# Altium project STM_32.PrjPcb
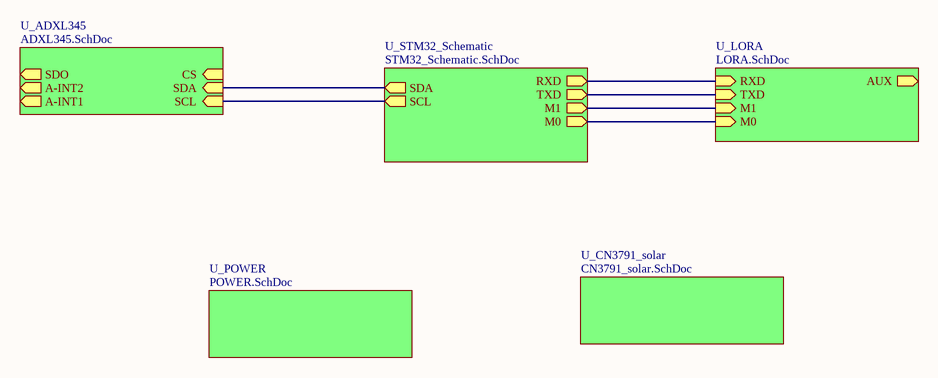
[diagram p0: Overview.SchDoc]
6 sheets, 61 parts. Net scope: hierarchical (ports join the sheet entries above them; power ports are global).
Board file: cuong.PcbDoc
Sheets:
  Overview.SchDoc
    U_STM32_Schematic = STM32_Schematic.SchDoc
    U_ADXL345 = ADXL345.SchDoc
    U_LORA = LORA.SchDoc
    U_POWER = POWER.SchDoc
    U_CN3791_solar = CN3791_solar.SchDoc

## Sheet Overview.SchDoc
size A; SheetNumber: 1; SheetTotal: 6

### Sub-sheets
U_ADXL345 = ADXL345.SchDoc: SCL (in), SDA (in), A-INT1 (out), A-INT2 (out), SDO (out), CS (in)
U_CN3791_solar = CN3791_solar.SchDoc: no entries
U_LORA = LORA.SchDoc: AUX (out), RXD (in), TXD (in), M0 (in), M1 (in)
U_POWER = POWER.SchDoc: no entries
U_STM32_Schematic = STM32_Schematic.SchDoc: RXD (out), TXD (out), M1 (out), M0 (out), SDA (out), SCL (out)

### Nets
NetR14_1: sheet U_STM32_Schematic/SCL, sheet U_ADXL345/SCL
NetR16_1: sheet U_STM32_Schematic/SDA, sheet U_ADXL345/SDA
NetU1_17: sheet U_STM32_Schematic/M0, sheet U_LORA/M0
NetU1_29: sheet U_STM32_Schematic/M1, sheet U_LORA/M1
NetU1_30: sheet U_STM32_Schematic/RXD, sheet U_LORA/RXD
NetU1_31: sheet U_STM32_Schematic/TXD, sheet U_LORA/TXD

## Sheet STM32_Schematic.SchDoc
size A4; SheetNumber: 4; SheetTotal: 6
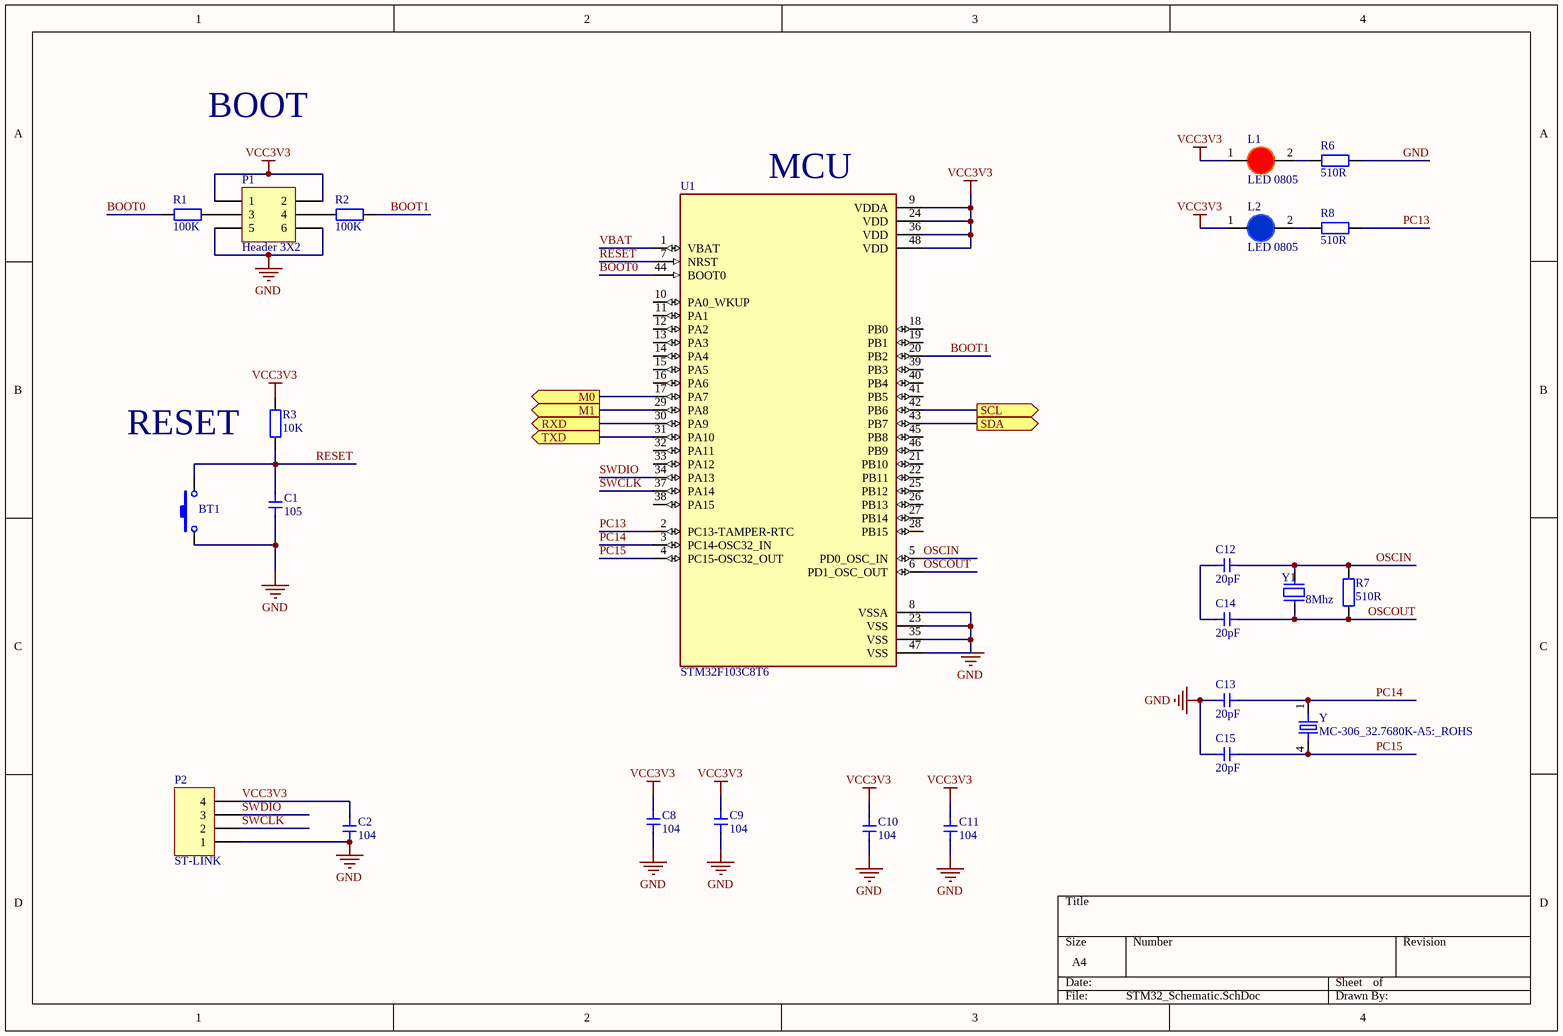
[diagram p1: STM32_Schematic.SchDoc]

### Parts
BT1  Nut Nhan 2 Chan SMD 3x6x2.5  [Nut Nhan 2 Chan SMD 3x6x2.5]  (value not drawn)
C1  105  [Cap 0805]
C2  104  [Cap 0805]
C8  104  [Cap 0805]
C9  104  [Cap 0805]
C10  104  [Cap 0805]
C11  104  [Cap 0805]
C12  20pF  [Cap 0805]
C13  20pF  [Cap 0805]
C14  20pF  [Cap 0805]
C15  20pF  [Cap 0805]
L1  LED 0805  [LED-0805-Red]
L2  LED 0805  [LED-0805-Blue]
P1  Header 3X2  [HDR2X3]
P2  ST-LINK  [HDR1X4]
R1  100K  [tro smd 0805]
R2  100K  [tro smd 0805]
R3  10K  [tro smd 0805]
R6  510R  [tro smd 0805]
R7  510R  [tro smd 0805]
R8  510R  [tro smd 0805]
U1  STM32F103C8T6  [QFP50P900X900X160-48N]
Y  MC-306_32.7680K-A5:_ROHS  [OSCL550P800X320X254-4N]
Y1  8Mhz  [Thach Anh 2 chan SMD5032]

### Ports
M0 (out), M1 (out), RXD (out), SCL (out), SDA (out), TXD (out)

### Nets
GND: BT1.1 C1.1 C2.1 C8.1 C9.1 C10.1 C11.1 C13.2 C15.2 P1.5 P1.6 P2.1 R6.2 U1.8(VSSA) U1.23(VSS) U1.35(VSS) U1.47(VSS)
VCC3V3: C2.2 C8.2 C9.2 C10.2 C11.2 L1.1(A) L2.1(A) P1.1 P1.2 P2.4 R3.2 U1.9(VDDA) U1.24(VDD) U1.36(VDD) U1.48(VDD)
BOOT0: R1.2 U1.44(BOOT0)
BOOT1: R2.1 U1.20(PB2)
OSCIN: C12.1 R7.2 U1.5(PD0_OSC_IN) Y1.1
OSCOUT: C14.1 R7.1 U1.6(PD1_OSC_OUT) Y1.2
PC13: R8.2 U1.2(PC13-TAMPER-RTC)
PC14: C13.1 U1.3(PC14-OSC32_IN) Y.1
PC15: C15.1 U1.4(PC15-OSC32_OUT) Y.4
RESET: BT1.2 C1.2 R3.1 U1.7(NRST)
SWCLK: P2.2 U1.37(PA14)
SWDIO: P2.3 U1.34(PA13)
VBAT: U1.1(VBAT)
NetC12_2: C12.2 C14.2
NetL1_2: L1.2(K) R6.1
NetL2_2: L2.2(K) R8.1
NetP1_3: P1.3 R1.1
NetP1_4: P1.4 R2.2
NetR14_1: U1.42(PB6) ; port SCL
NetR16_1: U1.43(PB7) ; port SDA
NetU1_17: U1.17(PA7) ; port M0
NetU1_29: U1.29(PA8) ; port M1
NetU1_30: U1.30(PA9) ; port RXD
NetU1_31: U1.31(PA10) ; port TXD

Not connected (* = marked no-connect by the designer): U1 10(PA0_WKUP) 11(PA1) 12(PA2) 13(PA3) 14(PA4) 15(PA5) 16(PA6) 18(PB0) 19(PB1) 21(PB10) 22(PB11) 25(PB12) 26(PB13) 27(PB14) 28(PB15) 32(PA11) 33(PA12) 38(PA15) 39(PB3) 40(PB4) 41(PB5) 45(PB8) 46(PB9)

### Notes on the sheet
- BOOT
- (near U1) MCU
- RESET

### Library data of the parts
BT1 = Nut Nhan 2 Chan SMD 3x6x2.5: Ma_Hang: MH001036; Ten: Nút Nhấn 2 Chân 3x6x2.5MM SMD
C1 C2 C8-C15 = Cap 0805: Capacitor SMD 0805
L1 = LED 0805 Do: Dán; Don_Vi: Con; Ma_Hang: MH000897; Ten_Linh_Kien: LED 0805 Màu Đỏ (Red); Ghi_Chu: *; Kieu_Chan: *; Chung_Loai: Dán
L2 = LED 0805 Xanh Duong: Dán; Don_Vi: Con; Ma_Hang: MH002327; Ten_Linh_Kien: LED 0805 Màu Xanh Dương (Blue); Ghi_Chu: *; Kieu_Chan: *; Chung_Loai: Dán
P1 = Header 3X2: Header, 3-Pin, Dual row; LatestRevisionDate: 17-Jul-2002; LatestRevisionNote: Re-released for DXP Platform.; Publisher: Altium Limited
P2 = Header 4: Header, 4-Pin; LatestRevisionDate: 17-Jul-2002; LatestRevisionNote: Re-released for DXP Platform.; Publisher: Altium Limited
R1-R3 R6-R8 = Tro 0805 1% 0.5R: Dán; Don_Vi: Con; So_Chan: 2; Ten_Linh_Kien: Trở 0805 1% 0.5R; Ma_Hang: MH005465; Chung_Loai: Dán; Kieu_Chan: *
U1 = STM32F103C8T6: ARM® Cortex®-M3 STM32F1 Microcontroller IC 32-Bit 72MHz 64KB (64K x 8) FLASH 48-LQFP (7x7); MF: STMicroelectronics; SnapEDA_Link: https://www.snapeda.com/parts/STM32F103C8T6/STMicroelectronics/view-part/?ref=snap; Package: LQFP-48 STMicroelectronics; Value: *; MP: STM32F103C8T6; Check_prices: https://www.snapeda.com/parts/STM32F103C8T6/STMicroelectronics/view-part/?ref=eda
Y = MC-306_32.7680K-A5:_ROHS: 32.768kHz Â±100ppm Crystal 12.5pF 50 kOhms 4-SOJ, 5.50mm pitch; MP: MC-306 32.7680K-A5: ROHS; MF: EPSON; Price: None; Availability: Unavailable; Package: 4-4 Epson; SnapEDA_Link: https://www.snapeda.com/parts/MC-306%2032.7680K-A5%3A%20ROHS/EPSON/view-part/620500/?ref=snap; Value: *
Y1 = Thach Anh 2 chan SMD 5032: Crystal For all Crystal 2pin.; Value: 4Mhz

## Sheet ADXL345.SchDoc
size A; SheetNumber: 3; SheetTotal: 6
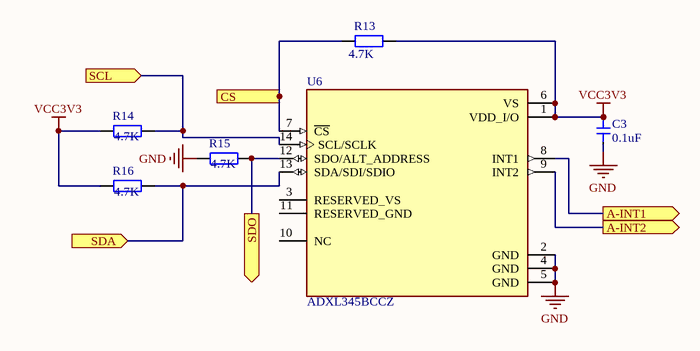
[diagram p2: ADXL345.SchDoc]

### Parts
C3  0.1uF  [Cap 0805]
R13  4.7K  [tro smd 0805]
R14  4.7K  [tro smd 0805]
R15  4.7K  [tro smd 0805]
R16  4.7K  [tro smd 0805]
U6  ADXL345BCCZ  [IC_ADXL345BCCZ]

### Ports
A-INT1 (out), A-INT2 (out), CS (in), SCL (in), SDA (in), SDO (out)

### Nets
GND: C3.2 R15.2 U6.2(GND) U6.4(GND) U6.5(GND)
VCC3V3: C3.1 R13.1 R14.2 R16.2 U6.1(VDD_I/O) U6.6(VS)
NetR13_2: R13.2 U6.7(~{CS}) ; port CS
NetR14_1: R14.1 U6.14(SCL/SCLK) ; port SCL
NetR15_1: R15.1 U6.12(SDO/ALT_ADDRESS) ; port SDO
NetR16_1: R16.1 U6.13(SDA/SDI/SDIO) ; port SDA
NetU6_8: U6.8(INT1) ; port A-INT1
NetU6_9: U6.9(INT2) ; port A-INT2

Not connected (* = marked no-connect by the designer): U6 3(RESERVED_VS) 10(NC) 11(RESERVED_GND)

### Library data of the parts
C3 = Cap 0805: Capacitor SMD 0805
R13-R16 = Tro 0805 1% 0.5R: as R1 on sheet STM32_Schematic; Chung_Loai: Dán; Kieu_Chan: *
U6 = ADXL345BCCZ: 3-Axis, Â±2 g/Â±4 g/Â±8 g/Â±16 g Digital Accelerometer; MF: Analog Devices; SnapEDA_Link: https://www.snapeda.com/parts/ADXL345BCCZ/Analog+Devices/view-part/?ref=snap; Package: LGA -14 Analog Devices; Value: *; MP: ADXL345BCCZ; Check_prices: https://www.snapeda.com/parts/ADXL345BCCZ/Analog+Devices/view-part/?ref=eda

## Sheet LORA.SchDoc
size A; SheetNumber: 6; SheetTotal: 6
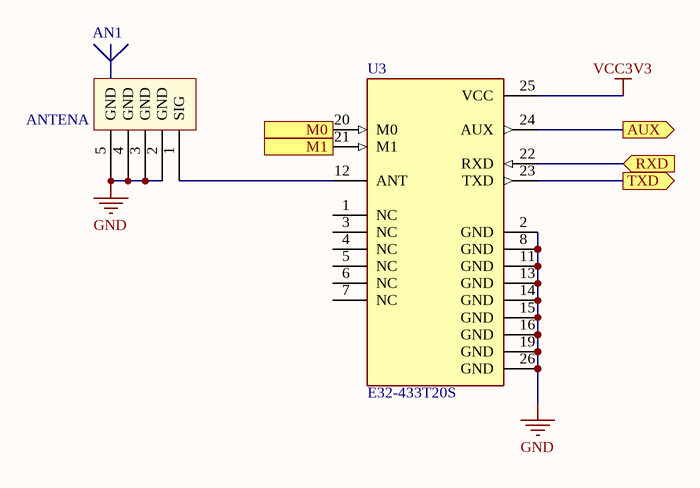
[diagram p3: LORA.SchDoc]

### Parts
AN1  ANTENA  [De Anten SMA SMD]
U3  E32-433T20S  [MODULE_E32-433T20S]

### Ports
AUX (out), M0 (in), M1 (in), RXD (in), TXD (out)

### Nets
GND: AN1.2(GND) AN1.3(GND) AN1.4(GND) AN1.5(GND) U3.2(GND) U3.8(GND) U3.11(GND) U3.13(GND) U3.14(GND) U3.15(GND) U3.16(GND) U3.19(GND) U3.26(GND)
VCC3V3: U3.25(VCC)
NetAN1_1: AN1.1(SIG) U3.12(ANT)
NetU1_17: U3.20(M0) ; port M0
NetU1_29: U3.21(M1) ; port M1
NetU1_30: U3.22(RXD) ; port RXD
NetU1_31: U3.23(TXD) ; port TXD
NetU3_24: U3.24(AUX) ; port AUX

Not connected (* = marked no-connect by the designer): U3 1(NC) 3(NC) 4(NC) 5(NC) 6(NC) 7(NC)

### Library data of the parts
AN1 = ANTEN SMA THANG: Generic Antenna
U3 = E32-433T20S: Wireless serial port module (UART); MF: EBYTE; Check_prices: https://www.snapeda.com/parts/E32-433T20S/EBYTE/view-part/?ref=eda; Package: Package; MP: E32-433T20S; Value: *; SnapEDA_Link: https://www.snapeda.com/parts/E32-433T20S/EBYTE/view-part/?ref=snap; Price: None; Availability: Not in stock

## Sheet POWER.SchDoc
size A; SheetNumber: 5; SheetTotal: 6
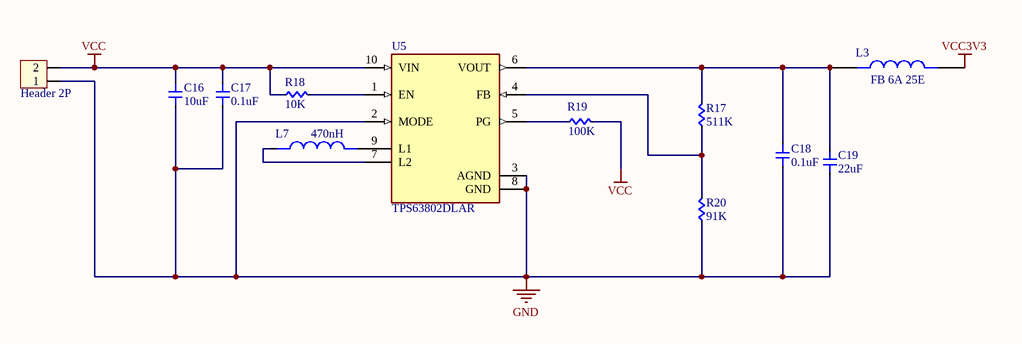
[diagram p4: POWER.SchDoc]

### Parts
C16  10uF  [Cap 0805]
C17  0.1uF  [Cap 0805]
C18  0.1uF  [Cap 0805]
C19  22uF  [Cap 0805]
H1  Header 2P  [XH2.54M-2]
L3  FB 6A 25E  [INDC2012X145N]
L7  470nH  [CUON CAM SMD 0530]
R17  511K  [RES 0805]
R18  10K  [RES 0805]
R19  100K  [RES 0805]
R20  91K  [RES 0805]
U5  TPS63802DLAR  [VREG_TPS63802DLAR]

### Nets
GND: C16.2 C17.2 C18.2 C19.2 H1.1 R20.1 U5.2(MODE) U5.3(AGND) U5.8(GND)
VCC: C16.1 C17.1 H1.2 R18.1 R19.2 U5.10(VIN)
VCC3V3: L3.2
NetC18_1: C18.1 C19.1 L3.1 R17.2 U5.6(VOUT)
NetL7_1: L7.1 U5.7(L2)
NetL7_2: L7.2 U5.9(L1)
NetR17_1: R17.1 R20.2 U5.4(FB)
NetR18_2: R18.2 U5.1(EN)
NetR19_1: R19.1 U5.5(PG)

### Library data of the parts
C16-C19 = Cap 0805: Capacitor SMD 0805
H1 = Header 2P 2.54 Duc Thang: Cắm; Ten_Linh_Kien: Header 2P XH2.54-2P Đực Thẳng; Don_Vi: Con; Ma_Hang: MH001283; Chung_Loai: Cắm
L3 = MLZ2012N220LT000: 22 ÂµH Shielded Multilayer Inductor 300 mA 670mOhm 0805 (2012 Metric); MF: TDK; SnapEDA_Link: https://www.snapeda.com/parts/MLZ2012N220LT000/TDK/view-part/?ref=snap; Package: 2012 Bourns; Value: *; MP: MLZ2012N220LT000; Check_prices: https://www.snapeda.com/parts/MLZ2012N220LT000/TDK/view-part/?ref=eda
L7 = Cuon Cam SMD 0530: SMD 0530; MP: FDV0530-H-1R5M=P3; Package: None; Price: None; Value: *; Availability: Unavailable
R17 R19 R20 = RES 0805: RES SMD 0805; Manufacturer: Vishay Dale; Manufacturer Part Number: CRCW040210K0FKED; Resistance (Ohms): 10k; Tolerance: ±1%; Power (Watts): 0.063W, 1/16W; Temperature Coefficient: ±100ppm/°C; Supplier 1: Digi-Key; RoHS: RoHS Compliant; Category: Resistors; Stock 1: 2392462; Pricing 1: 10=0.083, 50=0.0444, 200=0.0255, 1000=0.0174 (USD); Packaging: Cut Tape (CT); Composition: Thick Film; Features: Automotive AEC-Q200; Operating Temperature: -55°C ~ 155°C; Package / Case: 0402 (1005 Metric); Supplier Device Package: 0402 (1005 Metric); Size / Dimension: 0.039" L x 0.020" W (1.00mm x 0.50mm); Height: 0.016" (0.40mm); Number of Terminations: 2; ComponentLink1URL: http://www.vishay.com/docs/20035/dcrcwe3.pdf; ComponentLink1Description: http://www.vishay.com/docs/20035/dcrcwe3.pdf; Supplier Part Number 1: 541-10.0KLCT-ND
R18 = RES 0805: RES SMD 0805; Manufacturer: Vishay Dale; Manufacturer Part Number: CRCW040210K0FKED; Tolerance: ±1%; Power (Watts): 0.063W, 1/16W; Temperature Coefficient: ±100ppm/°C; Supplier 1: Digi-Key; RoHS: RoHS Compliant; Category: Resistors; Stock 1: 2392462; Pricing 1: 10=0.083, 50=0.0444, 200=0.0255, 1000=0.0174 (USD); Packaging: Cut Tape (CT); Resistance (Ohms): 10k; Composition: Thick Film; Features: Automotive AEC-Q200; Operating Temperature: -55°C ~ 155°C; Package / Case: 0402 (1005 Metric); Supplier Device Package: 0402 (1005 Metric); Size / Dimension: 0.039" L x 0.020" W (1.00mm x 0.50mm); Height: 0.016" (0.40mm); Number of Terminations: 2; ComponentLink1URL: http://www.vishay.com/docs/20035/dcrcwe3.pdf; ComponentLink1Description: http://www.vishay.com/docs/20035/dcrcwe3.pdf; Supplier Part Number 1: 541-10.0KLCT-ND
U5 = TPS63802DLAR: 2-A, high-efficient, 11-ÂµA quiescent current buck-boost converter in QFN/DFN package; MF: Texas Instruments; SnapEDA_Link: https://www.snapeda.com/parts/TPS63802DLAR/Texas+Instruments/view-part/?ref=snap; Package: VSON-HR-10 Texas Instruments; Value: *; MP: TPS63802DLAR; Check_prices: https://www.snapeda.com/parts/TPS63802DLAR/Texas+Instruments/view-part/?ref=eda

## Sheet CN3791_solar.SchDoc
size A; SheetNumber: 2; SheetTotal: 6
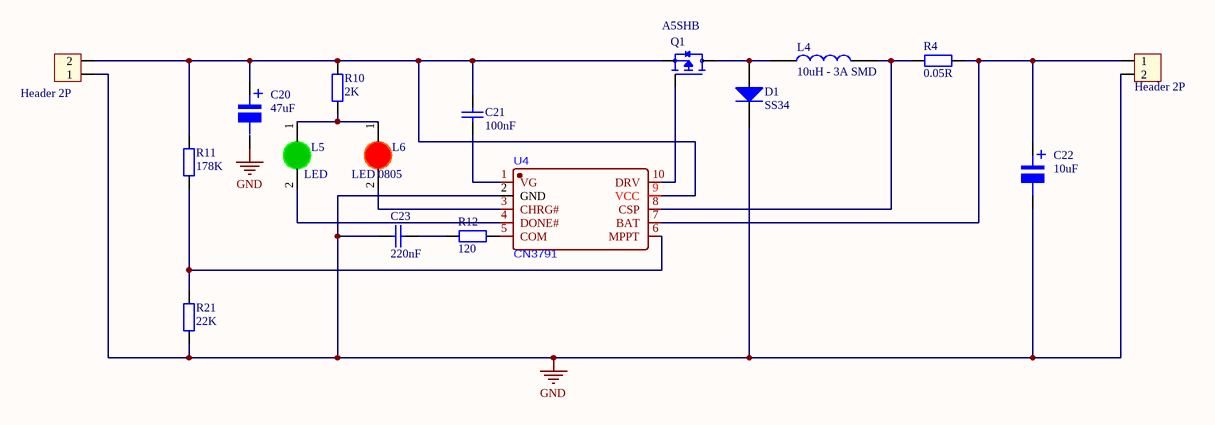
[diagram p5: CN3791_solar.SchDoc]

### Parts
C20  47uF  [tu nhom 5 (c)]
C21  100nF  [tu 0805]
C22  10uF  [tu nhom 5 (c)]
C23  220nF  [tu 0805]
D1  SS34  [DIODE SMA]
H2  Header 2P  [XH2.54M-2]
H3  Header 2P  [XH2.54M-2]
L4  10uH - 3A SMD  [CUON CAM SMD 0530]
L5  LED  [LED-0805-Green]
L6  LED 0805  [LED-0805-Red]
Q1  A5SHB  [TRANS_MMFTP2319]
R4  0.05R  [tro smd 2512]
R10  2K  [tro smd 0805]
R11  178K  [tro smd 0805]
R12  120  [tro smd 0805]
R21  22K  [tro smd 0805]
U4  CN3791  [SSOP-10_L4.9-W3.9-P1.00-LS6.0-BL]

### Nets
GND: C20.2 C22.2 C23.2 D1.2(K) H2.1 H3.2 R21.1 U4.2(GND)
NetC20_1: C20.1 C21.1 H2.2 Q1.2(S) R10.2 R11.2 U4.9(VCC)
NetC21_2: C21.2 U4.1(VG)
NetC22_1: C22.1 H3.1 R4.2 U4.7(BAT)
NetC23_1: C23.1 R12.1
NetD1_1: D1.1(A) L4.1 Q1.3(D)
NetL4_2: L4.2 R4.1 U4.8(CSP)
NetL5_1: L5.1(A) L6.1(A) R10.1
NetL5_2: L5.2(K) U4.4(DONE#)
NetL6_2: L6.2(K) U4.3(CHRG#)
NetQ1_1: Q1.1(G) U4.10(DRV)
NetR11_1: R11.1 R21.2 U4.6(MPPT)
NetR12_2: R12.2 U4.5(COM)

### Notes on the sheet
- (in symbol Tu Nhom 10uF 20V) +

### Library data of the parts
C20 C22 = Tu Nhom 10uF 20V: Dán; Don_Vi: Con; So_Chan: 2; Ten_Linh_Kien: Tụ Nhôm 10uF 20V; Ma_Hang: MH004016; Chung_Loai: Dán; Kieu_Chan: *
C21 C23 = Tu 0805 33nF 50V 20%: Dán; Don_Vi: Con; So_Chan: 2; Ten_Linh_Kien: Tụ 0805 33nF 50V 20%; Ma_Hang: MH007854; Kieu_Chan: *; Chung_Loai: Dán
D1 = Diode SS34 ( 1N5822 ): Dán; Don_Vi: Con; Ma_Hang: MH002104; Ten_Linh_Kien: Diode SS34 3A 40V SMA ( 1N5822 SS34A); Kieu_Chan: *; Chung_Loai: Dán
H2 H3 = Header 2P 2.54 Duc Thang: as H1 on sheet POWER; Chung_Loai: Cắm
L4 = CUON CAM 100uH SMD: Dán; Don_Vi: Con; Ma_Hang: MH003999; Ten_Linh_Kien: Cuộn Cảm 100uH 7x7x4MM CD74; Ma_Hang: *; Kieu_Chan: *; Chung_Loai: Dán
L5 = LED 0805 Xanh La: Dán; Don_Vi: Con; Ma_Hang: MH002326; Ten_Linh_Kien: LED 0805 Màu Xanh Lá (Green); Ghi_Chu: *; Kieu_Chan: *; Chung_Loai: Dán
L6 = LED 0805 Do: as L1 on sheet STM32_Schematic; Ghi_Chu: *; Kieu_Chan: *; Chung_Loai: Dán
Q1 = MMFTP2319: MOSFET, SOT-23, P, -40V, -4.2A, 0.08â„¦, 150Â°C; MF: Diotec Semiconductor; SnapEDA_Link: https://www.snapeda.com/parts/MMFTP2319/Diotec/view-part/?ref=snap; Package: SOT-23 Diotec; Value: *; MP: MMFTP2319; Check_prices: https://www.snapeda.com/parts/MMFTP2319/Diotec/view-part/?ref=eda
R4 = Tro 2512 5% 0.5R: Dán; Don_Vi: Con; So_Chan: 2; Ten_Linh_Kien: Trở 2512 5% R500-0.5R 1W; Ma_Hang: MH003431; Chung_Loai: Dán; Kieu_Chan: *
R10-R12 R21 = Tro 0805 1% 1k: Dán; Don_Vi: Con; So_Chan: 2; Ten_Linh_Kien: Trở 0805 1% 1k; Ma_Hang: MH005468; Chung_Loai: Dán; Kieu_Chan: *

## Nets that join several sheets
GND: STM32_Schematic (17 pins), ADXL345 (5 pins), LORA (13 pins), POWER (9 pins), CN3791_solar (8 pins)
VCC3V3: STM32_Schematic (15 pins), ADXL345 (6 pins), LORA (U3.25), POWER (L3.2)
NetR14_1: STM32_Schematic (U1.42), ADXL345 (R14.1 U6.14)
NetR16_1: STM32_Schematic (U1.43), ADXL345 (R16.1 U6.13)
NetU1_17: STM32_Schematic (U1.17), LORA (U3.20)
NetU1_29: STM32_Schematic (U1.29), LORA (U3.21)
NetU1_30: STM32_Schematic (U1.30), LORA (U3.22)
NetU1_31: STM32_Schematic (U1.31), LORA (U3.23)